# EAGLE design main (EAGLE 8.5.2)
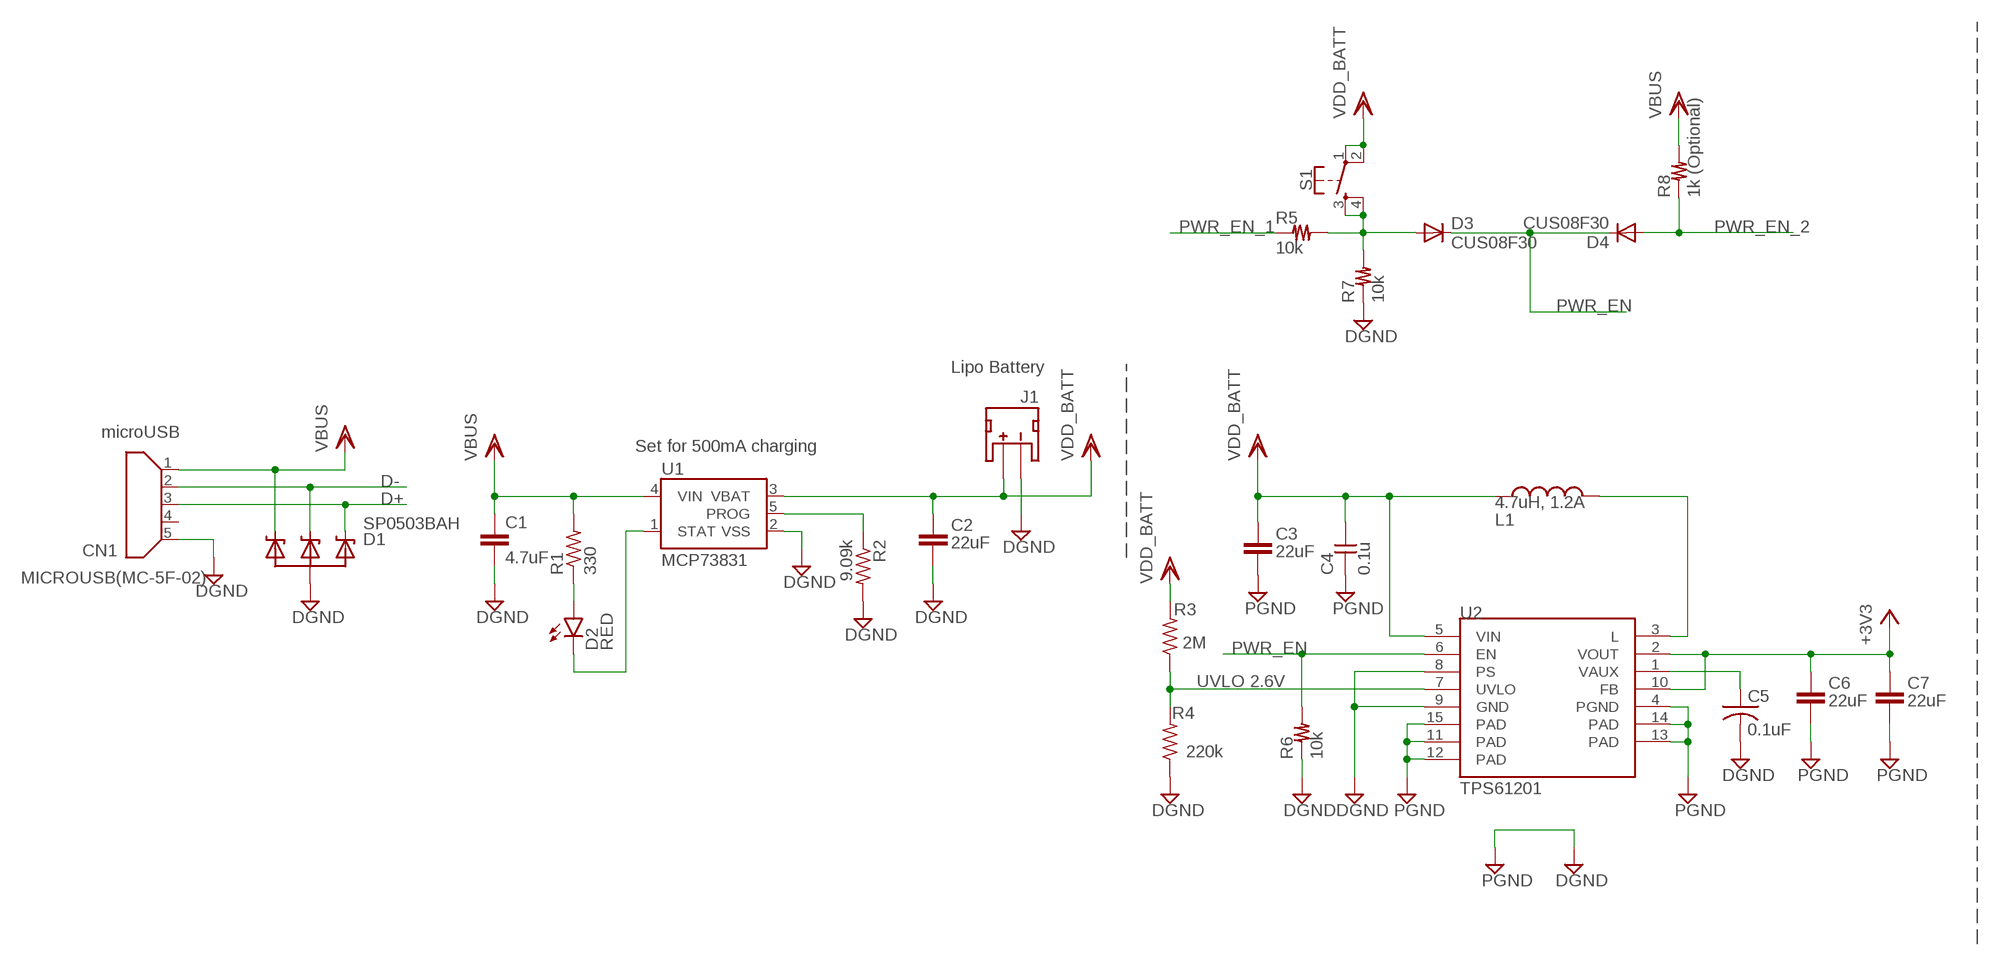
[diagram p0: schematic, sheet 1, part 1 of 2]
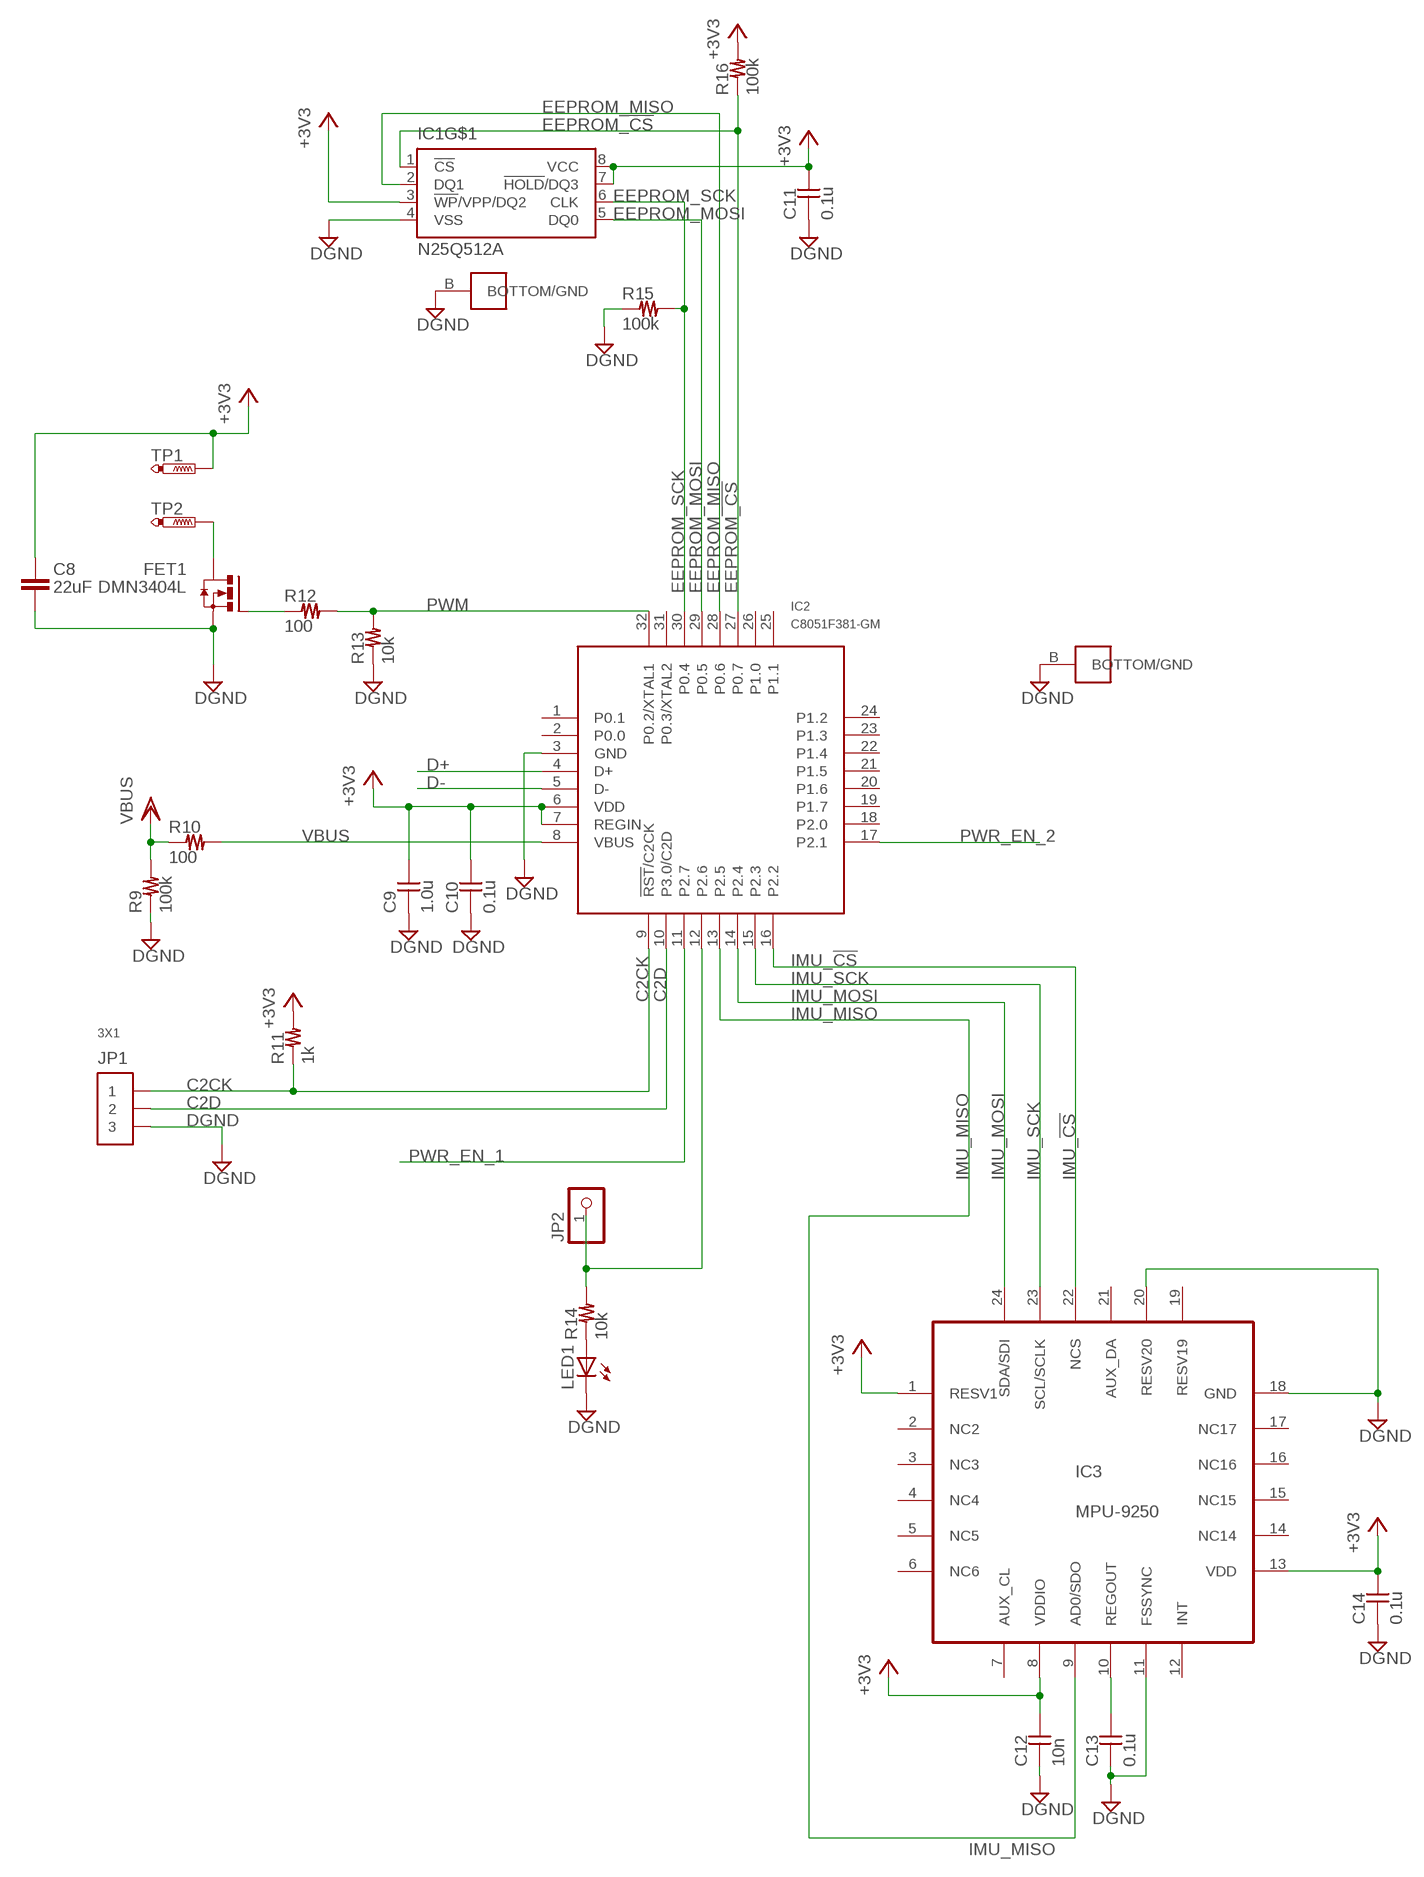
[diagram p1: schematic, sheet 1, part 2 of 2]

## Parts
C1  4.7uF  4.7UF-6.3V-10%(0603)0603  [0603-CAP]
C2  22uF  CAP0805  [0805]
C3  22uF  CAP0805  [0805]
C4  0.1u  C-1005  [1005]
C5  0.1uF  C-USC0402K  [C0402K]
C6  22uF  CAP0805  [0805]
C7  22uF  CAP0805  [0805]
C8  22uF  CAP0805  [0805]
C9  1.0u  C-1005  [1005]
C10  0.1u  C-1005  [1005]
C11  0.1u  C-1005  [1005]
C12  10n  C-1005  [1005]
C13  0.1u  C-1005  [1005]
C14  0.1u  C-1005  [1005]
CN1  MICROUSB(MC-5F-02)  [MICROUSB(MC-5F-02)]
D1  SP0503BAH  [SOT143]
D2  RED  LED-RED0603  [LED-0603]
D3  CUS08F30  DIODE-SOD323-W  [SOD323-W]
D4  CUS08F30  DIODE-SOD323-W  [SOD323-W]
FET1  DMN3404L  [SOT23]
IC1  N25Q512A  [V-PDFN-8]
IC2  C8051F381-GM  [QFN32]
IC3  MPU-9250  [QFN-24]
J1  JST  JST_2MM_MALE  [JST-2-SMD]
JP1  3X1  [MA3-1]
JP2  PINHD-1X1  [1X01]
L1  4.7uH, 1.2A  INDUCTOR.  [CDRH2D09]
LED1  LED1608O  [1608-OLI]
R1  330  R-US_R0402  [R0402]
R2  9.09k  R-US_R0402  [R0402]
R3  2M  R-US_R0402  [R0402]
R4  220k  R-US_R0402  [R0402]
R5  10k  R-1005  [1005]
R6  10k  R-1005  [1005]
R7  10k  R-1005  [1005]
R8  1k (Optional)  R-1005  [1005]
R9  100k  R-1005  [1005]
R10  100  R-1005  [1005]
R11  1k  R-1005  [1005]
R12  100  R-1005  [1005]
R13  10k  R-1005  [1005]
R14  10k  R-1005  [1005]
R15  100k  R-1005  [1005]
R16  100k  R-1005  [1005]
S1  MOMENTARY-SWITCH-SPST-2-SMD-4.6X2.8MM  [TACTILE_SWITCH_SMD_4.6X2.8MM]
TP1  PTR1TP10R  [TP10R]
TP2  PTR1TP10R  [TP10R]
U1  MCP73831  [SOT23-5]
U2  TPS61201  TPS61200  [QFN-10_PAD]

## Nets
+3V3 [PWR]: C6.1 C7.1 C8.1 C9.P$2 C10.P$2 C11.P$2 C12.P$2 C14.P$2 IC1.3(!WP!/VPP/DQ2) IC1.7(!HOLD!/DQ3) IC1.8(VCC) IC2.6(VDD) IC2.7(REGIN) IC3.1(RESV1) IC3.8(VDDIO) IC3.13(VDD) R11.P$2 R16.P$2 TP1.TP U2.2(VOUT) U2.10(FB)
C2CK: IC2.9(!RST!/C2CK) JP1.1 R11.P$1
C2D: IC2.10(P3.0/C2D) JP1.2
D+: CN1.3 D1.2 IC2.4(D+)
D-: CN1.2 D1.3 IC2.5(D-)
DGND: C1.2 C2.2 C3.2 C4.P$1 C5.2 C6.2 C7.2 C8.2 C9.P$1 C10.P$1 C11.P$1 C12.P$1 C13.P$1 C14.P$1 CN1.5 D1.1 FET1.S IC1.4(VSS) IC1.B(BOTTOM/GND) IC2.3(GND) IC2.B(BOTTOM/GND) IC3.11(FSSYNC) IC3.18(GND) IC3.20(RESV20) J1.1(-) JP1.3 LED1.K R2.2 R4.1 R6.P$1 R7.P$1 R9.P$1 R13.P$1 R15.P$1 U1.2(VSS) U2.4(PGND) U2.8(PS) U2.9(GND) U2.11(PAD) U2.12(PAD) U2.13(PAD) U2.14(PAD) U2.15(PAD) ; supply symbol labelled PGND
EEPROM_!CS: IC1.1(!CS) IC2.27(P0.7) R16.P$1
EEPROM_MISO: IC1.2(DQ1) IC2.28(P0.6)
EEPROM_MOSI: IC1.5(DQ0) IC2.29(P0.5)
EEPROM_SCK: IC1.6(CLK) IC2.30(P0.4) R15.P$2
IMU_!CS: IC2.16(P2.2) IC3.22(NCS)
IMU_MISO: IC2.13(P2.5) IC3.9(AD0/SDO)
IMU_MOSI: IC2.14(P2.4) IC3.24(SDA/SDI)
IMU_SCK: IC2.15(P2.3) IC3.23(SCL/SCLK)
LIN [PWR]: L1.P$1 U2.3(L)
N$3: D2.A R1.1
N$8: FET1.G R12.P$1
N$9: LED1.A R14.P$1
N$10: FET1.D TP2.TP
N$11: D3.A R5.P$2 R7.P$2 S1.3 S1.4
N$13: C13.P$2 IC3.10(REGOUT)
N$15: IC2.12(P2.6) JP2.1 R14.P$2
N$18: IC2.8(VBUS) R10.P$2
PROG: R2.1 U1.5(PROG)
PWM: IC2.32(P0.2/XTAL1) R12.P$2 R13.P$2
PWR_EN: D3.C D4.C R6.P$2 U2.6(EN)
PWR_EN_1: IC2.11(P2.7) R5.P$1
PWR_EN_2: D4.A IC2.17(P2.1) R8.P$1
STAT: D2.C U1.1(STAT)
UVLO: R3.1 R4.2 U2.7(UVLO)
VAUX: C5.1 U2.1(VAUX)
VBUS: C1.1 CN1.1 D1.4 R1.2 R8.P$2 R9.P$2 R10.P$1 U1.4(VIN)
VDD_BATT: C2.1 C3.1 C4.P$2 J1.2(+) L1.P$2 R3.2 S1.1 S1.2 U1.3(VBAT) U2.5(VIN)
Unconnected: CN1.4 IC2.1(P0.1) IC2.2(P0.0) IC2.18(P2.0) IC2.19(P1.7) IC2.20(P1.6) IC2.21(P1.5) IC2.22(P1.4) IC2.23(P1.3) IC2.24(P1.2) IC2.25(P1.1) IC2.26(P1.0) IC2.31(P0.3/XTAL2) IC3.2(NC2) IC3.3(NC3) IC3.4(NC4) IC3.5(NC5) IC3.6(NC6) IC3.7(AUX_CL) IC3.12(INT) IC3.14(NC14) IC3.15(NC15) IC3.16(NC16) IC3.17(NC17) IC3.19(RESV19) IC3.21(AUX_DA) J1.NC1(PAD1) J1.NC2(PAD2)

## Notes on the sheet
- Lipo Battery
- microUSB
- Set for 500mA charging
- UVLO 2.6V

## Library data of the parts
C1 = SparkFun-Capacitors:4.7UF-6.3V-10%(0603): CAP-08280; PROD_ID: CAP-08280
C2 C3 C6-C8 = CH_passive:CAP: Capacitor Standard 0603 ceramic capacitor, and 0.1" leaded capacitor.
C4 C9-C14 = reg,cap:C-
C5 = rcl:C-US: CAPACITOR, American symbol; SPICEPREFIX: C
CN1 = Connector:MICROUSB(MC-5F-02)
D1 = diode:SP0503BAH
D2 = SparkFun-LED:LED-RED: Assorted Red LEDs LilyPad 1206- DIO-09912 1206- DIO-00809 0603- DIO-00819; PROD_ID: DIO-00819
D3 D4 = diode:DIODE-: DIODE
FET1 = MOSFET:DMN3404L
IC1 = EEPROM:N25Q512A
IC2 = C8051F34x:C8051F381-GM
IC3 = GYRO:MPU-9250
J1 = SparkFun-Connectors:JST_2MM_MALE: Mates to single-cell LiPo batteries. CONN-08352; PROD_ID: CONN-08352
JP1 = pin_header:3X1
JP2 = pinhead:PINHD-1X1: PIN HEADER
L1 = SparkFun:INDUCTOR: Inductors Basic Inductor/Choke - 0603 and 1206. Footprints are not proven and vary greatly between part numbers.
LED1 = LED:LED
R1-R4 = rcl:R-US_: RESISTOR, American symbol; SPICEPREFIX: R
R5-R16 = reg,cap:R-
S1 = SparkFun-Switches:MOMENTARY-SWITCH-SPST-2: Momentary Switch (Pushbutton) - SPST - Two Circuits Normally-open (NO) SPST momentary switches (buttons, pushbuttons). Schematic symbol includes two switch circuits. Variants SMD-4.6MMX2.8MM - 4.60mm x 2.80mm Tactile Momentary Button Switch - Used on SparkFun SAMD21 Mini Breakout <https://www.sparkfun.com/products/13664> SMD-5.2MM - Mini Pushbutton Switch - SMD <https://www.sparkfun.com/products/8720> - Used on Arduino Pro Mini <https://www.sparkfun.com/products/11114>; PROD_ID: SWCH-13065
TP1 TP2 = testpad:PTR1: TEST PIN
U1 = SparkFun-PowerIC:MCP73831: Miniature single cell, fully integrated Li-Ion, Li-polymer charge management controller http://ww1.microchip.com/downloads/en/DeviceDoc/21984a.pdf IC-09995; PROD_ID: IC-09995
U2 = SparkFun:TPS61200: DC to DC Booster

## Board
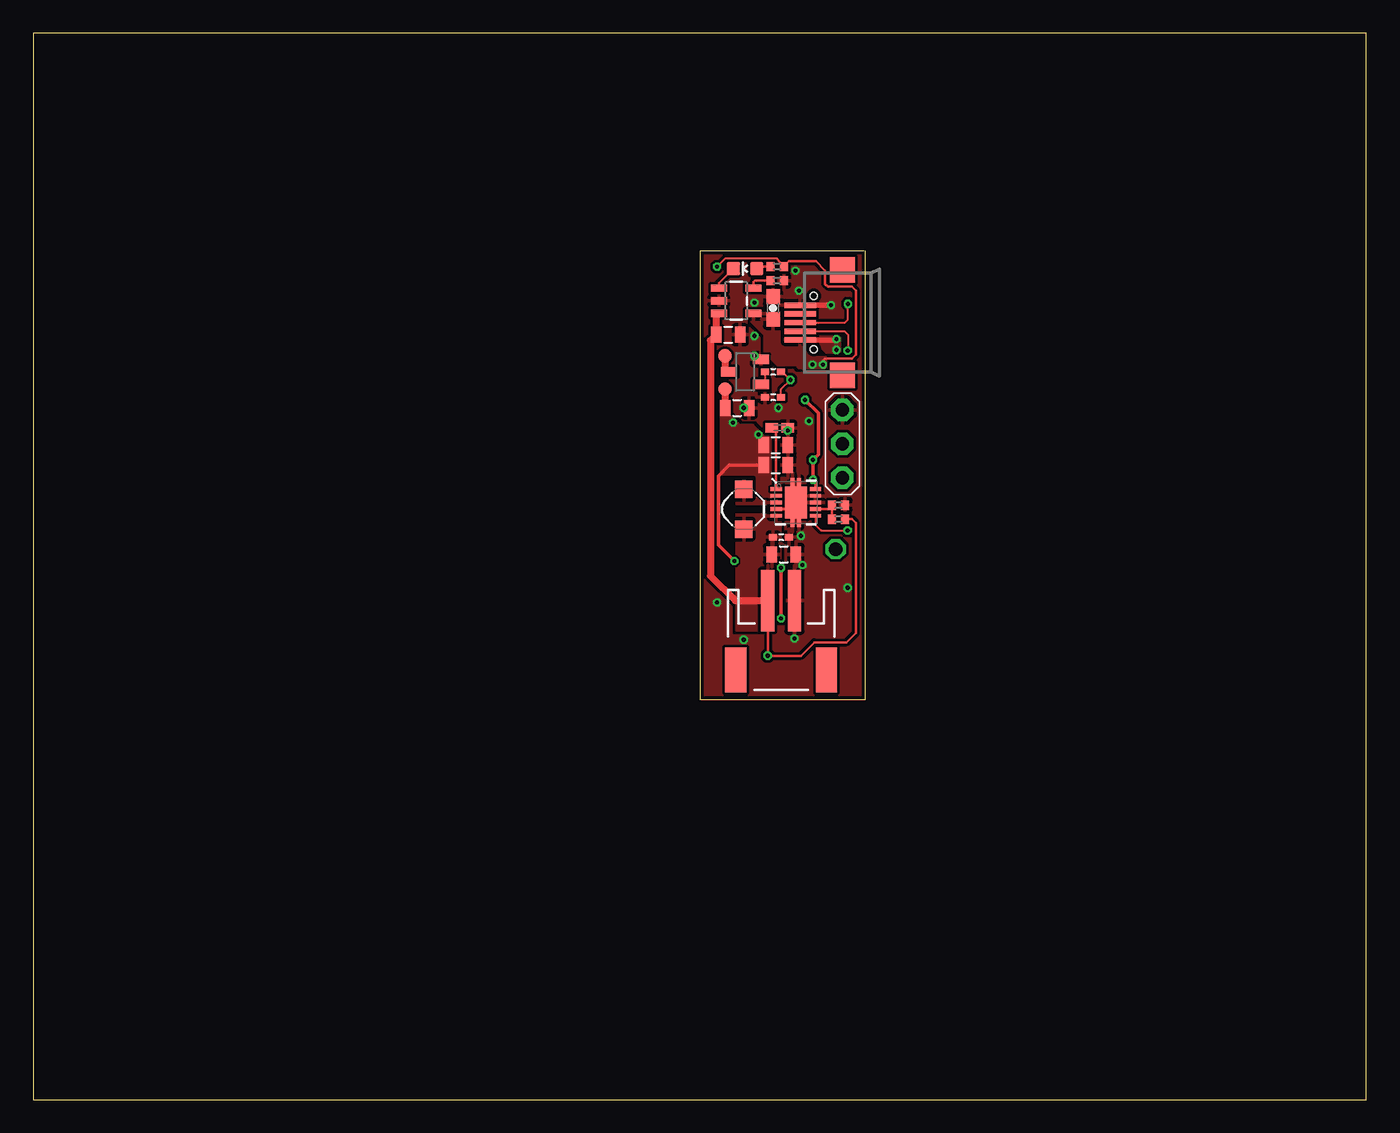
[diagram p2: board, top side]
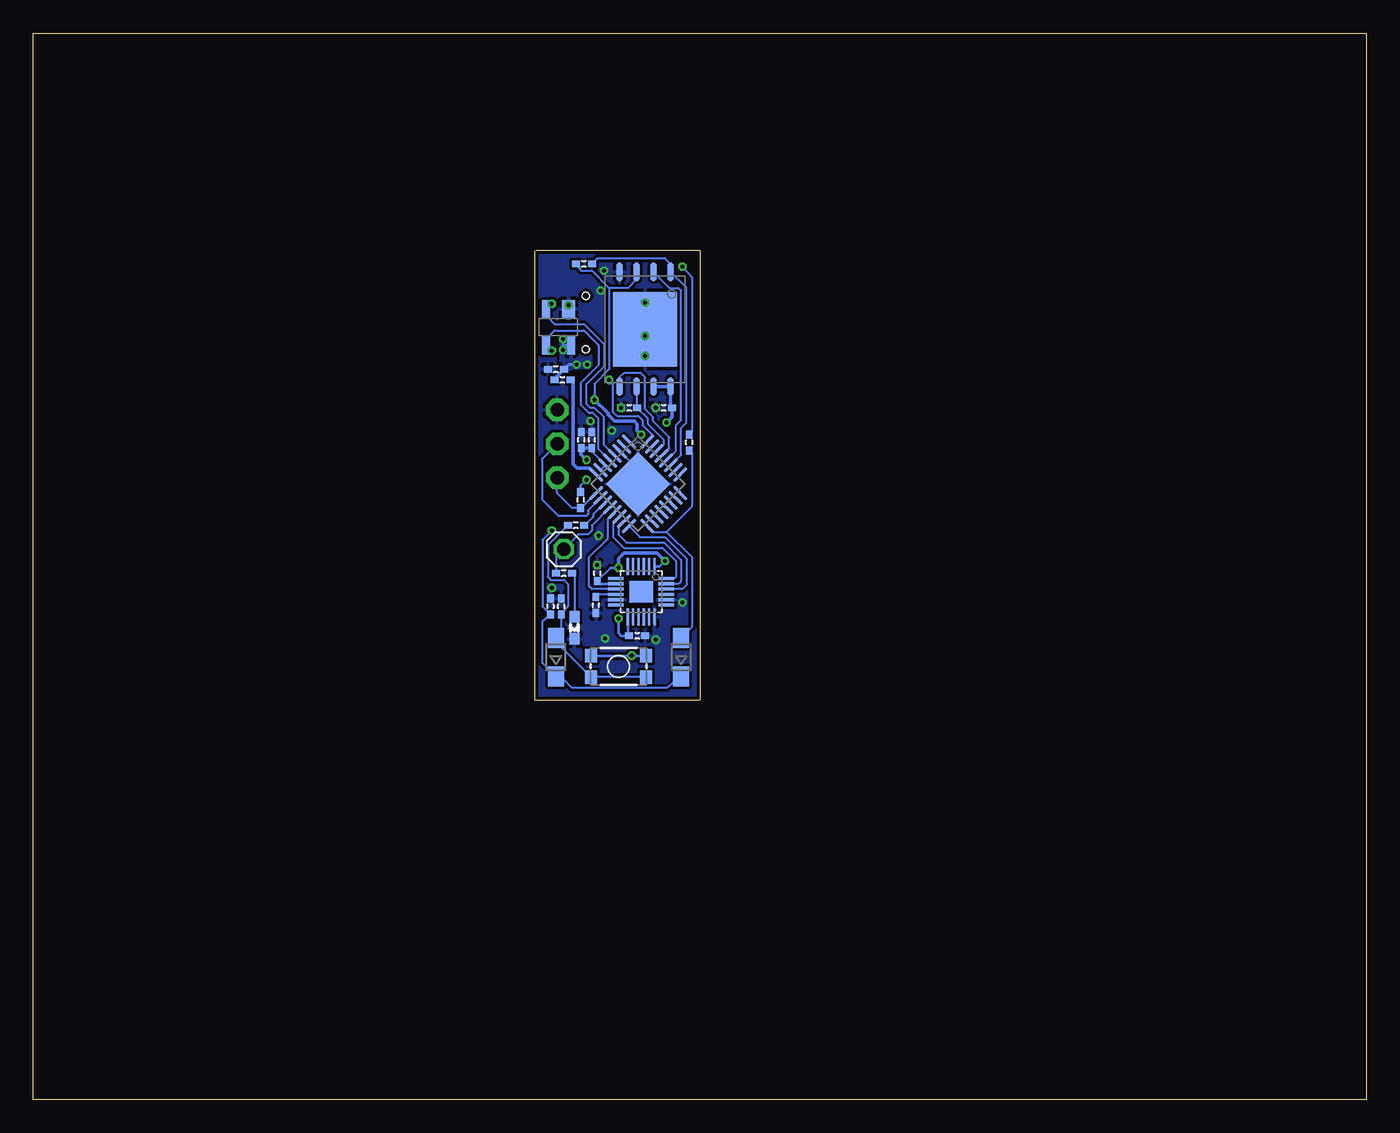
[diagram p3: board, bottom side, seen from below]

Size 100 x 80 mm. Coordinates in mm from the lower left corner, seen from the top.
Outline: 62.4,63.7 62.4,30 50,30 50,63.7 62.3,63.7
Outline: 0,0 100,0 100,80 0,80 0,0
Copper layers (1*16): Top 0.035mm / dielectric 1.5mm / Bottom 0.035mm
Design rules "SeeedStudio_2layer_DRU_no_angle_20140221": minimum track width 6mil, minimum drill 12mil, track to track 6mil, track to pad 6mil, pad to pad 6mil, via to via 6mil, smd to smd 0mil, copper to edge 10mil, drill to drill 10mil, minimum pad ring 10mil, minimum via ring 6mil, stop-mask expansion 2mil, vias tented up to drill 100mil, thermal gap 10mil
tRestrict: 4 lines

### Footprints (pad centres in the part's own frame; a part is rotated, then mirrored left to right if it is on the bottom)
0603-CAP = smd 1.1 x 1: 1 -0.85,0; 2 0.85,0
0805 = smd 0.8 x 1.2: 1 -0.9,0; 2 0.9,0
1005 = smd 0.6 x 0.5: P$1 -0.6,0; P$2 0.6,0
C0402K = smd 0.925 x 0.74: 1 -0.6,0; 2 0.6,0
MICROUSB(MC-5F-02) = smd 0.4 x 2.35: 1 -1.3,-0.175; 2 -0.65,-0.175; 3 0,-0.175; 4 0.65,-0.175; 5 1.3,-0.175 | smd 1.9 x 1.9: 6 -3.95,-3.35; 7 3.95,-3.35 | hole 0.55: -2,-1.2; 2,-1.2
SOT143 = smd 1 x 1.4: 1 -0.75,-1.35 | smd 0.6 x 1.4: 2 0.95,-1.35; 3 0.95,1.35; 4 -0.95,1.35
LED-0603 = smd 1 x 1: A 0,-0.877; C 0,0.877
SOD323-W = smd 1.5 x 1.2: A 1.45,0; C -1.45,0
SOT23 = smd 0.711 x 1.2: D 0,1.2; G -0.95,-1.2; S 0.95,-1.2
V-PDFN-8 = smd 1.4 x 0.5: 1 -4.3,1.905; 2 -4.3,0.635; 3 -4.3,-0.635; 4 -4.3,-1.905; 5 4.3,-1.905; 6 4.3,-0.635; 7 4.3,0.635; 8 4.3,1.905 | smd 5.6 x 4.8: B 0,0
QFN32 = smd 1.4 x 0.25: 1 -2.725,1.75; 2 -2.725,1.25; 3 -2.725,0.75; 4 -2.725,0.25; 5 -2.725,-0.25; 6 -2.725,-0.75; 7 -2.725,-1.25; 8 -2.725,-1.75; 17 2.725,-1.75; 18 2.725,-1.25; 19 2.725,-0.75; 20 2.725,-0.25; 21 2.725,0.25; 22 2.725,0.75; 23 2.725,1.25; 24 2.725,1.75 | smd 0.25 x 1.4: 9 -1.75,-2.725; 10 -1.25,-2.725; 11 -0.75,-2.725; 12 -0.25,-2.725; 13 0.25,-2.725; 14 0.75,-2.725; 15 1.25,-2.725; 16 1.75,-2.725; 25 1.75,2.725; 26 1.25,2.725; 27 0.75,2.725; 28 0.25,2.725; 29 -0.25,2.725; 30 -0.75,2.725; 31 -1.25,2.725; 32 -1.75,2.725 | smd 3.4 x 3.4: B 0,0
QFN-24 = smd 1.22 x 0.2: 1 -1.89,1; 2 -1.89,0.6; 3 -1.89,0.2; 4 -1.89,-0.2; 5 -1.89,-0.6; 6 -1.89,-1; 13 1.89,-1; 14 1.89,-0.6; 15 1.89,-0.2; 16 1.89,0.2; 17 1.89,0.6; 18 1.89,1 | smd 0.2 x 1.22: 7 -1,-1.89; 8 -0.6,-1.89; 9 -0.2,-1.89; 10 0.2,-1.89; 11 0.6,-1.89; 12 1,-1.89; 19 1,1.89; 20 0.6,1.89; 21 0.2,1.89; 22 -0.2,1.89; 23 -0.6,1.89; 24 -1,1.89 | smd 1.59 x 1.75: B 0,0
JST-2-SMD = smd 1 x 4.6: 1 -1,-3.7; 2 1,-3.7 | smd 1.6 x 3.4: NC1 -3.4,1.5; NC2 3.4,1.5
MA3-1 = drill 1 pad 1.676 octagon: 1 -2.54,0; 2 0,0; 3 2.54,0
1X01 = drill 1.016 octagon: 1 0,0
CDRH2D09 = smd 1.3 x 1.3: P$1 -1.5,0; P$2 1.5,0
1608-OLI = smd 0.89 x 0.76: A -0.825,0; K 0.825,0
R0402 = smd 0.6 x 0.7: 1 -0.5,0; 2 0.5,0
TACTILE_SWITCH_SMD_4.6X2.8MM = smd 0.9 x 1: 1 -2.05,-0.8; 2 2.05,-0.8; 3 2.05,0.8; 4 -2.05,0.8
TP10R = smd 1 x 1: TP 0,0
SOT23-5 = smd 0.55 x 1.2: 1 -0.95,-1.3; 2 0,-1.3; 3 0.95,-1.3; 4 0.95,1.3; 5 -0.95,1.3
QFN-10_PAD = smd 0.297 x 0.85: 1 -1,-1.475; 2 -0.5,-1.475; 3 0,-1.475; 4 0.5,-1.475; 5 1,-1.475; 6 1,1.475; 7 0.5,1.475; 8 0,1.475; 9 -0.5,1.475; 10 -1,1.475 | smd 0.7 x 0.28: 11 -1.5,0.25; 12 -1.5,-0.25; 13 1.5,0.25; 14 1.5,-0.25 | smd 2.4 x 1.65: 15 0,0

### Placement (x,y rotation side)
C1  55.5,59.4 90 top
C2  52.13,57.39 0 top
C3  56.3,40.9 0 top
C4  56.1,42.2 180 top
C5  56,50.4 0 top
C6  55.7,49.1 0 top
C7  55.7,47.6 0 top
C8  52.8,51.9 0 top
C9  58.1,49.5 270 bottom
C10  58.9,49.5 270 bottom
C11  52.7,51.9 0 bottom
C12  57.7,39.5 270 bottom
C13  57.8,37.1 90 bottom
C14  54.7,34.8 180 bottom
CN1  57.35,58.3 90 top
D1  60.6,57.95 180 bottom
D2  53.4,62.34 90 top
D3  60.8,33.2 90 bottom
D4  51.4,33.2 90 bottom
FET1  53.4,54.6 90 top
IC1  54.1,57.8 270 bottom
IC2  54.63,46.19 315 bottom
IC3  54.4,38.1 270 bottom
J1  56.1,33.73 180 top
JP1  60.7,49.2 90 top
JP2  60.2,41.3 90 bottom
L1  53.3,44.3 270 top
LED1  59.4,35.4 270 bottom
R1  55.8,62.5 0 top
R2  55.8,61.44 0 top
R3  60.4,43.55 0 top
R4  60.4,44.6 180 top
R5  59.3,43.1 180 bottom
R6  61.2,37 270 bottom
R7  60.4,37 270 bottom
R8  50.8,49.3 90 bottom
R9  60.8,54.8 0 bottom
R10  60.3,54 0 bottom
R11  58.94,44.99 90 bottom
R12  55.5,54.6 0 top
R13  55.5,52.7 0 top
R14  60.2,39.5 180 bottom
R15  55.3,51.9 0 bottom
R16  58.7,62.7 180 bottom
S1  56.1,32.5 180 bottom
TP1  51.9,53.3 180 top
TP2  51.9,55.8 180 top
U1  52.74,59.93 270 top
U2  57.2,44.8 270 top

### Tracks (layer width: path | path; a pad name or v marks a point on that pad's centre or on a via)
+3V3  (via drill 0.3)
  Top 0.203: U2.10 58.67,46.33 v58.5,46.5
  Top 0.254: v56.1,39.9 v56.1,36.1 | C7.1 52.2,47.6 51.4,46.8 51.4,41.6 v52.6,40.4 | v57.9,52.5 58.9,51.5 58.9,48.4 v58.5,48 v58.5,46.5
  Top 0.508: TP1.TP C8.1
  Bottom 0.152: IC1.3 54.78,61.52 55.4,60.9 56.8,60.9 | R16.P$2 58.9,62.2 58.1,62.2 56.8,60.9 | 56.8,60.9 56.8,54.8 57.9,53.7 v57.9,52.5
  Bottom 0.203: IC3.13 55.4,34.9 C14.P$2 55.9,34.8 56.1,35 v56.1,36.1 | IC3.8 57.5,38.7 C12.P$2 56.7,39.9 v56.1,39.9 | IC3.1 53.01,39.99 v52.6,40.4 | IC2.7 IC2.6 58.1,48.6 C9.P$2 | R11.P$2 58.94,46.06 v58.5,46.5
  Bottom 0.254: 53.51,53.05 IC1.7 IC1.8 52.2,51.99 C11.P$2 52.1,51.2 v52.5,50.8 | v52.6,40.4 53.2,41 55.7,41 56.1,40.6 v56.1,39.9 | v54.4,49.9 54.7,50.2 54.7,50.7 54.9,50.9 56.4,50.9 56.9,51.4 56.9,51.5 v57.9,52.5 | C9.P$2 C10.P$2 58.9,48.4 v58.5,48
  pour Top (rank 2, no thermals): 56.1,45.4 55.3,45.4 55.3,49.7 54.9,49.7 54,50.6 53,50.6 52.2,51.4 52.2,52.4 51.6,52.4 51.6,47 51.5,46.9 54.1,46.9 54.3,46.7 54.3,45.7 54.8,45.2 56.1,45.2
C2CK
  Bottom 0.152: IC2.9 58.91,44.39 R11.P$1 59.59,44.39 60.7,45.5 JP1.1
C2D
  Bottom 0.152: 57.89,44.7 IC2.10 58.4,44.19 58.4,43.9 58.5,43.8 60.6,43.8 61.8,45 61.8,48.1 JP1.2
D+  (via drill 0.3)
  Top 0.152: CN1.3 60.9,58.3 61.1,58.51 v61.1,59.7
  Bottom 0.152: IC2.4 57.2,49.12 57.2,51.2 57.9,51.9 58.2,51.9 58.5,52.2 58.5,53.7 57.2,55 57.2,56.7 58.7,58.2 60.9,58.2 61.55,58.85 D1.2 61.51,59.3 v61.1,59.7
D-  (via drill 0.3)
  Top 0.152: CN1.2 60.85,57.65 61.1,57.4 v61.1,56.2
  Bottom 0.152: IC2.5 57.6,48.81 57.6,51.1 58,51.5 58.3,51.5 58.9,52.1 58.9,53.8 57.6,55.1 57.6,56.6 58.7,57.7 60.9,57.7 61.55,57.05 D1.3 61.5,56.6 v61.1,56.2
DGND  (via drill 0.3)
  Top 0.2: U2.4 56.7,44.3 U2.15 | U2.14 56.95,44.55 U2.15 | U2.13 57.45,44.55 U2.15 | U2.12 56.95,45.05 U2.15 | U2.11 57.45,45.05 U2.15
  Top 0.406: CN1.5 59.7,59.6
  Bottom 0.152: IC2.B 54.63,47.25 IC2.3
  other vias: 57.18,62.21 58.2,50.9 57.43,60.71 61.1,38.4 55.9,51.9 54.1,57.3 54.1,59.8 54.1,55.8 59.85,59.6 56.6,50.2 57.6,42.3 57.7,40.1 57.1,34.6 53.3,34.5 51.3,37.3 53.3,51.9
  pour Bottom (isolate 0.203, rank 6): 49.6,63.88 62.5,63.88 62.5,29.87 49.6,29.87
  pour Top (isolate 0.203, rank 6): 49.6,63.88 62.5,63.88 62.5,29.87 49.6,29.87
EEPROM_!CS
  Bottom 0.152: R16.P$1 57.7,63.1 52.6,63.1 52.2,62.7 IC1.1 51,60.91 51,50.8 51.4,50.4 51.4,48.36 IC2.27
EEPROM_MISO
  Bottom 0.152: IC1.2 52.27,60.9 51.6,60.9 51.4,60.7 51.4,51 51.8,50.6 51.8,48.67 IC2.28
EEPROM_MOSI
  Bottom 0.152: IC2.29 52.3,48.88 52.3,49.7 53.5,50.9 53.5,51.2 54.1,51.8 54.1,54.2 54.4,54.5 55.7,54.5 56.01,54.2 IC1.5
EEPROM_SCK
  Bottom 0.152: IC2.30 52.7,49.18 52.7,49.5 53.9,50.7 53.9,51.1 R15.P$2 54.73,51.94 IC1.6
IMU_!CS
  Bottom 0.152: IC2.16 54.49,42.2 52.6,42.2 51,40.6 51,38.6 51.3,38.3 IC3.22
IMU_MISO
  Bottom 0.152: IC2.13 56.9,43.57 56.9,42.1 58.3,40.7 58.3,38.5 58.1,38.3 IC3.9
IMU_MOSI
  Bottom 0.152: IC2.14 56.5,43.26 56.5,42.2 55.7,41.4 52.8,41.4 51.8,40.4 51.8,39.2 51.9,39.1 IC3.24
IMU_SCK
  Bottom 0.152: IC2.15 56.1,42.95 56.1,42.4 55.5,41.8 52.7,41.8 51.4,40.5 51.4,38.9 51.6,38.7 IC3.23
LIN
  pour Top: 56.1,44.9 54.5,44.9 53.8,45.6 53.8,46.4 52.7,46.4 52.7,44.7 56.1,44.7
N$3
  Top 0.203: R1.1 54.43,62.5 D2.A
N$8
  Top 0.152: R12.P$1 54.9,53.95 FET1.G
N$9
  Bottom 0.152: R14.P$1 59.4,39.3 LED1.A
N$10
  Top 0.508: TP2.TP 51.9,54.9 FET1.D
N$11
  Bottom 0.152: R5.P$2 61.4,41.6 61.4,39.2 61.2,39 60.2,39 59.9,38.7 59.9,37 R7.P$2 60.4,35.05 D3.A 60.8,34.35 S1.3 S1.4
N$13
  Bottom 0.152: IC3.10 57.6,37.9 C13.P$2
N$15
  Bottom 0.152: IC2.12 58.1,43.08 58.1,42.7 58.4,42.4 59.1,42.4 JP2.1 60.8,40.7 R14.P$2
N$18
  Bottom 0.254: IC2.8 58.31,47.4 59.2,47.4 59.5,47.7 59.5,53.8 R10.P$2
PROG
  Top 0.203: R2.1 54.14,61.44 54.04,61.34 U1.5
PWM  (via drill 0.3)
  Top 0.152: R12.P$2 56.2,54.6 v56.8,54 56.1,53.3 R13.P$2
  Bottom 0.152: v56.8,54 56.5,53.7 56.5,51.6 56.2,51.3 54.6,51.3 54.3,51 54.3,50.6 53.6,49.9 53.6,49.7 IC2.32
PWR_EN  (via drill 0.3)
  Top 0.152: U2.6 58.67,43.12 59.1,42.7 v61.1,42.7
  Bottom 0.152: D4.C 52.45,30.9 59.6,30.9 60.45,31.75 D3.C 61.8,32.75 61.8,35.9 R6.P$2 61.8,37 61.8,42 v61.1,42.7
PWR_EN_1
  Bottom 0.152: IC2.11 58,43.88 58,43.7 58.6,43.1 R5.P$1
PWR_EN_2
  Bottom 0.152: R8.P$1 50.6,48.5 50.6,44.5 52.5,42.6 | IC2.17 53.51,42.6 52.5,42.6 | 52.5,42.6 50.6,40.7 50.6,35.45 D4.A
STAT
  Top 0.203: D2.C 51.44,61.26 U1.1
UVLO
  Top 0.203: R3.1 59.9,44.3 | 59.9,44.3 R4.2 | U2.7 59.9,44.3
VAUX
  Top 0.203: C5.1 55.73,50.08 U2.1
VBUS  (via drill 0.3)
  Top 0.152: R1.2 55.8,63.1 51.9,63.1 v51.3,62.5
  Top 0.203: R1.2 56.7,62.9 58.7,62.9 59.4,62.2 59.4,61.2 59.6,61 61.4,61 61.7,60.7 61.7,55.9 61.4,55.6 59.4,55.6 59.25,55.45 v59.25,55.15
  Top 0.406: CN1.1 60.2,57 v60.25,57.05
  Bottom 0.152: v51.3,62.5 50.6,61.7 50.6,50.1 R8.P$2 | 60.25,56.6 v60.25,57.05 | 60.25,56.6 D1.4 59.81,56.6 59.81,56.81 | 60.25,56.6 v60.25,56.25
  Bottom 0.254: 59.81,56.81 59.81,56.93 | R10.P$1 60.9,54.1 R9.P$2 59.85,55.15 v59.25,55.15
  other vias: 58.45,55.15
  pour Top: 56.4,57.1 58.7,57.1 58.9,57.3 60.4,57.3 60.5,57.2 60.5,56.1 60.4,56 59.5,56 58.6,56.9 56.4,56.9
  pour Bottom: 60.4,57.3 60.5,57.2 60.5,54.7 59.7,54.7 59.5,54.9 58.3,54.9 58.1,55.1 58.1,55.8 58.2,55.9 58.8,55.9 59.4,56.5 59.4,57.3
  pour Top: 59.4,54.9 59.5,55 59.5,55.7 58.5,55.7 57.6,56.6 56.2,56.6 56,56.8 56,59.2 53.5,59.2 53.5,58.7 54.8,57.4 54.8,56.1 55.8,55.1 57.2,55.1 57.4,54.9
VDD_BATT  (via drill 0.3)
  Top 0.203: J1.2 v55.1,33.3 57.6,33.3 58.6,34.3 61,34.3 61.7,35 61.7,43.25 61.4,43.55 R3.2
  Top 0.254: J1.2 55.14,37.29 55.14,35.43 55.18,35.38
  Top 0.508: J1.2 52.67,37.43 50.8,39.3 50.8,56.96 C2.1 51.23,58.76 U1.3
  Bottom 0.203: S1.1 v55.1,33.3 S1.2
  pour Top: 55.5,35.2 55.5,40 56.1,40.6 56.1,43.9 52.7,43.9 52.7,35.2